# EAGLE design sensor (EAGLE 9.6.2)
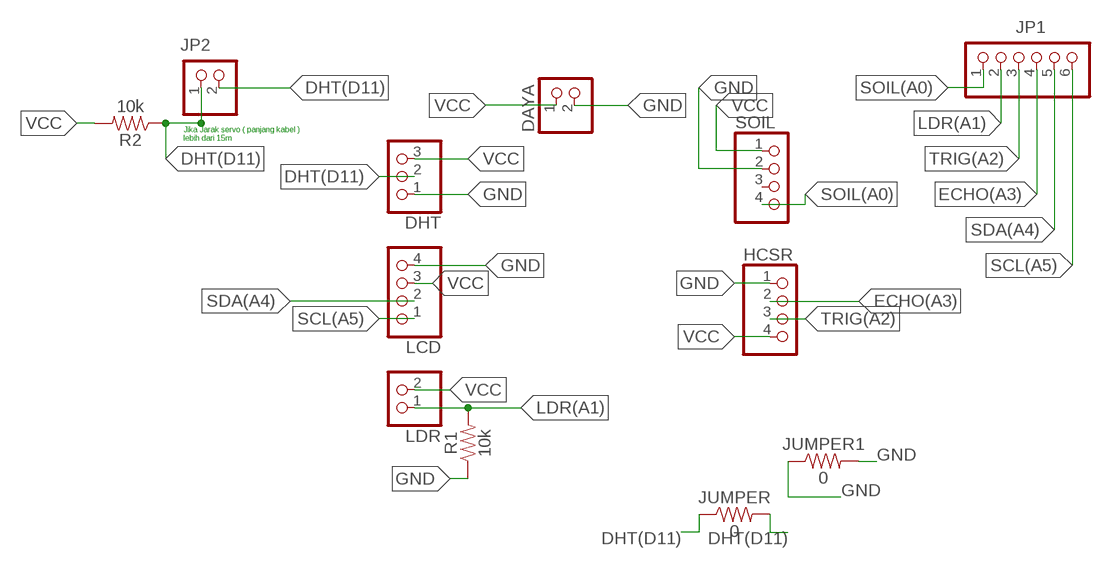
[diagram p0: schematic, sheet 1]

## Parts
DAYA  PINHD-1X2  [1X02]
DHT  PINHD-1X3  [1X03]
HCSR  PINHD-1X4  [1X04]
JP1  PINHD-1X6  [1X06]
JP2  PINHD-1X2  [1X02]
JUMPER  0  1KOHM-HORIZ-1/4W-1%  [AXIAL-0.3]
JUMPER1  0  1KOHM-HORIZ-1/4W-1%  [AXIAL-0.3]
LCD  PINHD-1X4  [1X04]
LDR  PINHD-1X2  [1X02]
R1  10k  10KOHM-HORIZ-1/4W-5%  [AXIAL-0.3]
R2  10k  10KOHM-HORIZ-1/4W-5%  [AXIAL-0.3]
SOIL  PINHD-1X4  [1X04]

## Nets
DHT(D11): DHT.2 JP2.1 JP2.2 JUMPER.P$1 JUMPER.P$2 R2.P$1
ECHO(A3): HCSR.2 JP1.4
GND: DAYA.2 DHT.1 HCSR.1 JUMPER1.P$1 JUMPER1.P$2 LCD.4 R1.P$1 SOIL.2
LDR(A1): JP1.2 LDR.1 R1.P$2
SCL(A5): JP1.6 LCD.1
SDA(A4): JP1.5 LCD.2
SOIL(A0): JP1.1 SOIL.4
TRIG(A2): HCSR.3 JP1.3
VCC: DAYA.1 DHT.3 HCSR.4 LCD.3 LDR.2 R2.P$2 SOIL.1
Unconnected: SOIL.3

## Notes on the sheet
- Jika Jarak servo ( panjang kabel )
  lebih dari 15m

## Library data of the parts
DAYA JP2 LDR = pinhead:PINHD-1X2: PIN HEADER
DHT = pinhead:PINHD-1X3: PIN HEADER
HCSR LCD SOIL = pinhead:PINHD-1X4: PIN HEADER
JP1 = pinhead:PINHD-1X6: PIN HEADER
JUMPER JUMPER1 = SparkFun-Resistors:1KOHM: 1kΩ resistor A resistor is a passive two-terminal electrical component that implements electrical resistance as a circuit element. Resistors act to reduce current flow, and, at the same time, act to lower voltage levels within circuits. - Wikipedia; PROD_ID: RES-12182; VALUE: 1k
R1 R2 = SparkFun-Resistors:10KOHM: 10kΩ resistor A resistor is a passive two-terminal electrical component that implements electrical resistance as a circuit element. Resistors act to reduce current flow, and, at the same time, act to lower voltage levels within circuits. - Wikipedia; PROD_ID: RES-09435

## Board
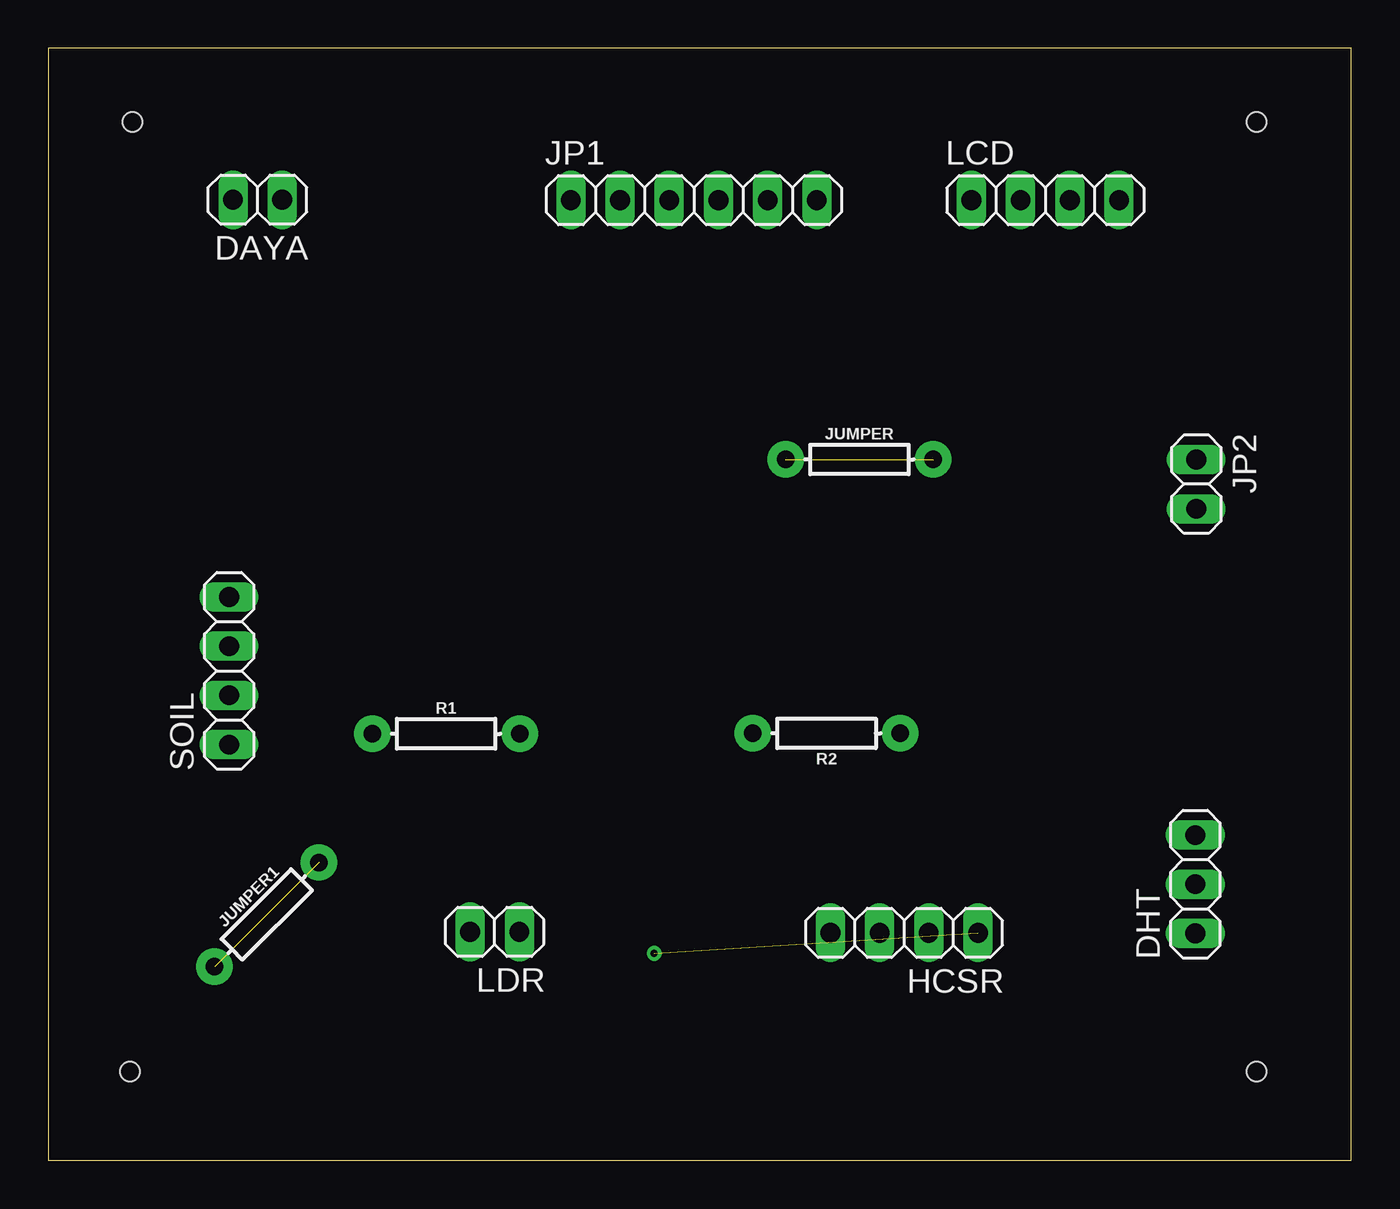
[diagram p1: board, top side]
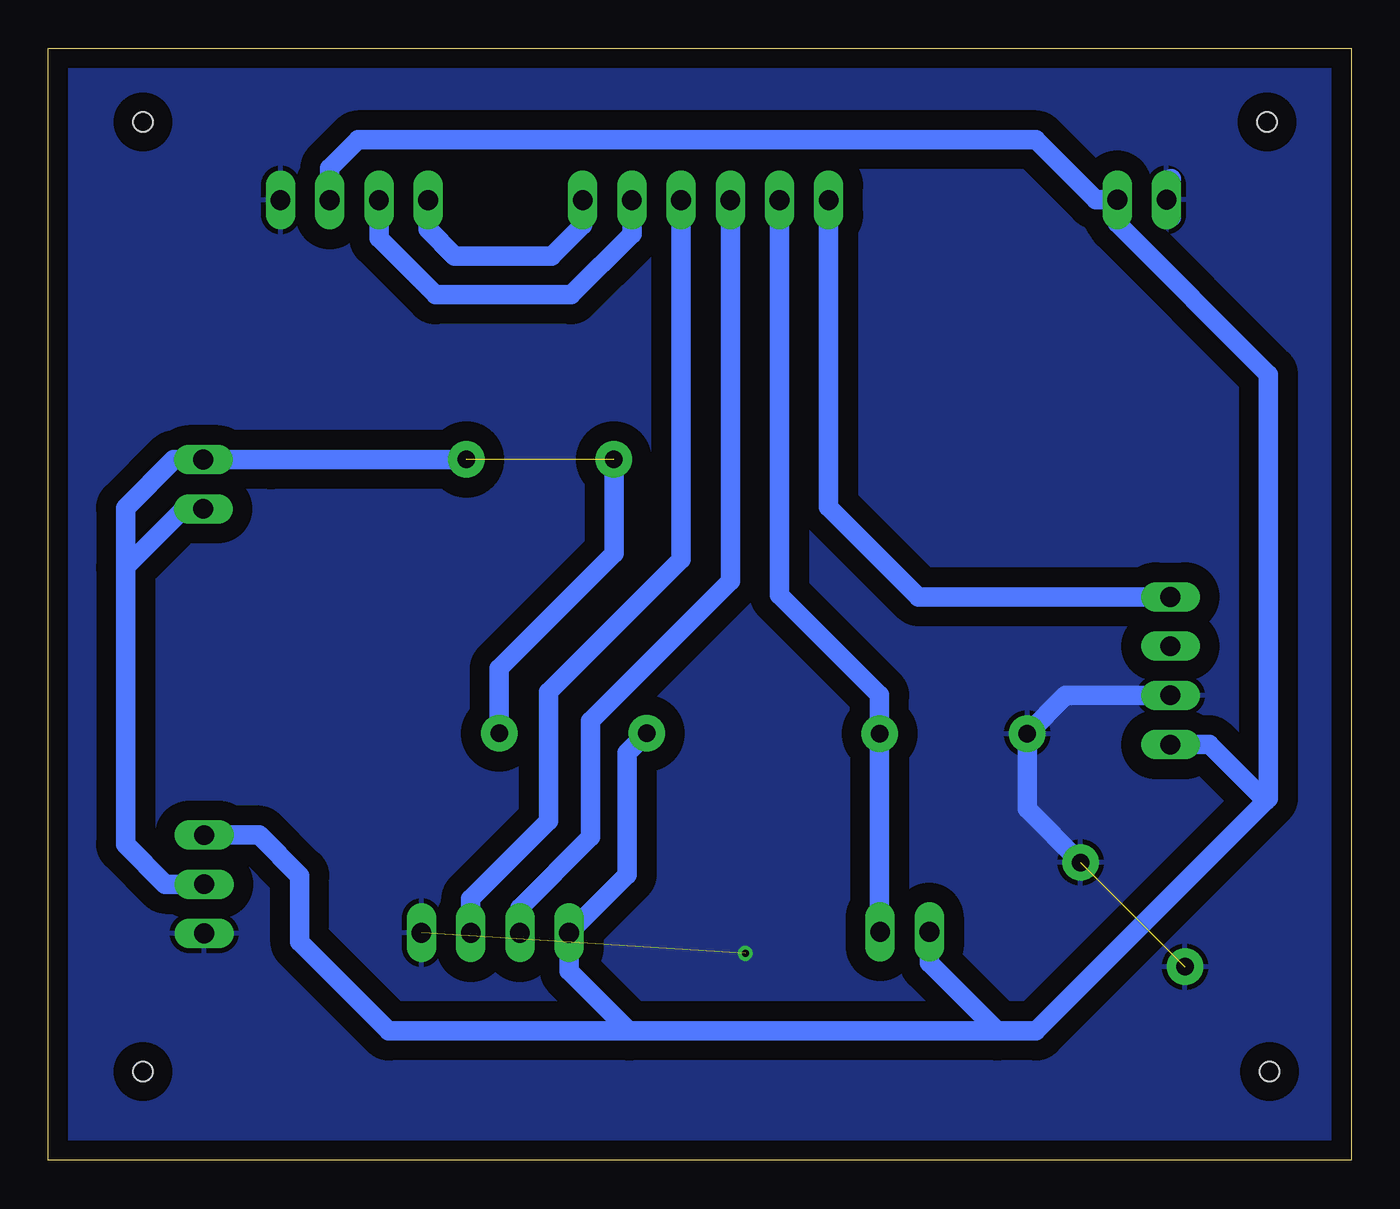
[diagram p2: board, bottom side, seen from below]

Size 67.25 x 57.41 mm. Coordinates in mm from the lower left corner, seen from the top.
Outline: 0,0 67.25,0 67.25,57.41 0,57.41 0,0
Copper layers (1*16): Top 0.035mm / dielectric 1.5mm / Bottom 0.035mm
Design rules "default": minimum track width 6mil, minimum drill 0.35mm, track to track 6mil, track to pad 6mil, pad to pad 6mil, via to via 6mil, smd to smd 6mil, copper to edge 40mil, drill to drill 6mil, minimum pad ring 10mil, minimum via ring 8mil, stop-mask expansion 4mil, vias tented up to drill 0mil, thermal gap 10mil
Holes 1 mm at 4.33,53.61 62.37,53.61 62.37,4.59 4.21,4.59

### Footprints (pad centres in the part's own frame; a part is rotated, then mirrored left to right if it is on the bottom)
1X02 = drill 1.016 long: 1 -1.27,0; 2 1.27,0
1X03 = drill 1.016 long: 1 -2.54,0; 2 0,0; 3 2.54,0
1X04 = drill 1.016 long: 1 -3.81,0; 2 -1.27,0; 3 1.27,0; 4 3.81,0
1X06 = drill 1.016 long: 1 -6.35,0; 2 -3.81,0; 3 -1.27,0; 4 1.27,0; 5 3.81,0; 6 6.35,0
AXIAL-0.3 = drill 0.9 pad 1.88: P$1 -3.81,0; P$2 3.81,0

### Placement (x,y rotation side)
DAYA  10.8,49.6 180 top
DHT  59.21,14.26 90 top
HCSR  44.18,11.75 180 top
JP1  33.32,49.58 0 top
JP2  59.26,34.91 270 top
JUMPER  41.87,36.19 0 top
JUMPER1  11.27,12.69 45 top
LCD  51.46,49.58 0 top
LDR  23.04,11.8 180 top
R1  20.53,22.03 0 top
R2  40.17,22.05 180 top
SOIL  9.33,25.28 90 top

### Tracks (layer width: path | path; a pad name or v marks a point on that pad's centre or on a via)
DHT(D11)  (1 unrouted)
  Bottom 1.016: 63.27,30.63 60.26,33.64 JP2.2 | 63.27,30.63 63.27,16.32 61.21,14.26 DHT.2 | 63.27,30.63 63.27,33.69 60.78,36.18 JP2.1 55.76,36.18 55.75,36.19 JUMPER.P$2 | R2.P$1 43.98,25.4 38.06,31.32 JUMPER.P$1
ECHO(A3)
  Bottom 1.016: HCSR.2 45.45,13.51 41.44,17.52 41.44,24.17 34.59,31.02 JP1.4
GND  (via drill 0.35)  (2 unrouted)
  Bottom 1.016: SOIL.2 14.74,24.01 R1.P$1 16.72,18.14 JUMPER1.P$2 | 9.27,48.69 9.53,48.95 DAYA.2 9.53,50.43 9.27,50.69
  other vias: 31.27,10.69
  pour Bottom (isolate 1.016): 0,57.41 0,0 67.25,0 67.25,57.41
LDR(A1)
  Bottom 1.016: JP1.2 29.51,29.2 24.34,24.03 R1.P$2 24.34,11.83 LDR.1
SCL(A5)
  Bottom 1.016: LCD.1 47.65,48.07 46.27,46.69 41.27,46.69 39.67,48.29 JP1.6
SDA(A4)
  Bottom 1.016: JP1.5 37.13,47.83 40.27,44.69 47.27,44.69 50.19,47.61 LCD.2
SOIL(A0)
  Bottom 1.016: JP1.1 26.97,33.73 22.33,29.09 SOIL.4
TRIG(A2)
  Bottom 1.016: HCSR.3 42.91,13.05 39.27,16.69 39.27,22.69 32.05,29.91 JP1.3
VCC
  Bottom 1.016: LCD.3 52.73,51.23 51.27,52.69 16.27,52.69 13.18,49.6 DAYA.1 12.07,48.38 4.27,40.58 4.27,18.69 4.41,18.55 | 4.41,18.55 16.27,6.69 18.27,6.69 | 37.27,6.69 49.68,6.69 54.27,11.28 54.27,14.69 56.38,16.8 DHT.3 | 37.27,6.69 40.37,9.79 HCSR.4 37.37,14.75 37.37,21.04 R2.P$2 | SOIL.1 7.33,21.47 4.41,18.55 | 18.27,6.69 37.27,6.69 | LDR.2 21.77,10.19 18.27,6.69